# Altium schematic sheet led.SchDoc
size A4; SheetNumber: 2; SheetTotal: 4
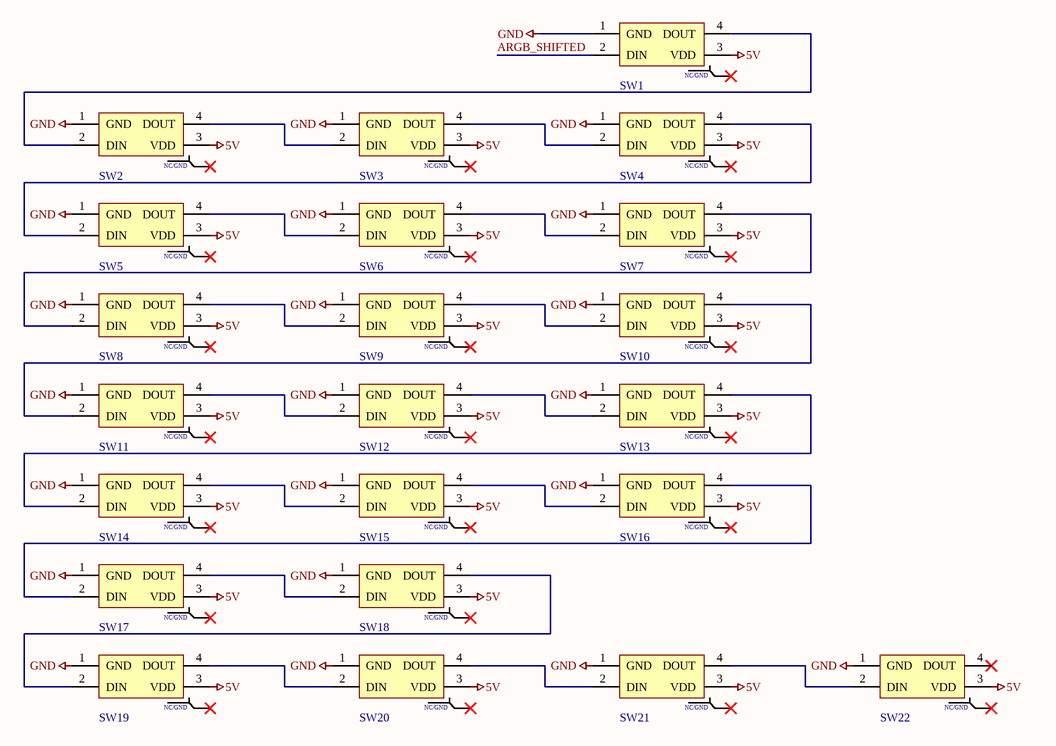
[diagram p0: led.SchDoc]

## Parts
SW1  Switch  [Switch]  (value not drawn)
SW2  Switch  [Switch]  (value not drawn)
SW3  Switch  [Switch]  (value not drawn)
SW4  Switch  [Switch]  (value not drawn)
SW5  Switch  [Switch]  (value not drawn)
SW6  Switch  [Switch]  (value not drawn)
SW7  Switch  [Switch]  (value not drawn)
SW8  Switch  [Switch]  (value not drawn)
SW9  Switch  [Switch]  (value not drawn)
SW10  Switch  [Switch]  (value not drawn)
SW11  Switch  [Switch]  (value not drawn)
SW12  Switch  [Switch]  (value not drawn)
SW13  Switch  [Switch]  (value not drawn)
SW14  Switch  [Switch]  (value not drawn)
SW15  Switch  [Switch]  (value not drawn)
SW16  Switch  [Switch]  (value not drawn)
SW17  Switch  [Switch]  (value not drawn)
SW18  Switch  [Switch]  (value not drawn)
SW19  Switch  [Switch]  (value not drawn)
SW20  Switch  [Switch]  (value not drawn)
SW21  Switch  [Switch]  (value not drawn)
SW22  Switch  [Switch]  (value not drawn)

## Nets
5V: SW1.3(VDD) SW2.3(VDD) SW3.3(VDD) SW4.3(VDD) SW5.3(VDD) SW6.3(VDD) SW7.3(VDD) SW8.3(VDD) SW9.3(VDD) SW10.3(VDD) SW11.3(VDD) SW12.3(VDD) SW13.3(VDD) SW14.3(VDD) SW15.3(VDD) SW16.3(VDD) SW17.3(VDD) SW18.3(VDD) SW19.3(VDD) SW20.3(VDD) SW21.3(VDD) SW22.3(VDD)
GND: SW1.1(GND) SW2.1(GND) SW3.1(GND) SW4.1(GND) SW5.1(GND) SW6.1(GND) SW7.1(GND) SW8.1(GND) SW9.1(GND) SW10.1(GND) SW11.1(GND) SW12.1(GND) SW13.1(GND) SW14.1(GND) SW15.1(GND) SW16.1(GND) SW17.1(GND) SW18.1(GND) SW19.1(GND) SW20.1(GND) SW21.1(GND) SW22.1(GND)
ARGB_SHIFTED: SW1.2(DIN)
NetSW1_4: SW1.4(DOUT) SW2.2(DIN)
NetSW2_4: SW2.4(DOUT) SW3.2(DIN)
NetSW3_4: SW3.4(DOUT) SW4.2(DIN)
NetSW4_4: SW4.4(DOUT) SW5.2(DIN)
NetSW5_4: SW5.4(DOUT) SW6.2(DIN)
NetSW6_4: SW6.4(DOUT) SW7.2(DIN)
NetSW7_4: SW7.4(DOUT) SW8.2(DIN)
NetSW8_4: SW8.4(DOUT) SW9.2(DIN)
NetSW9_4: SW9.4(DOUT) SW10.2(DIN)
NetSW10_4: SW10.4(DOUT) SW11.2(DIN)
NetSW11_4: SW11.4(DOUT) SW12.2(DIN)
NetSW12_4: SW12.4(DOUT) SW13.2(DIN)
NetSW13_4: SW13.4(DOUT) SW14.2(DIN)
NetSW14_4: SW14.4(DOUT) SW15.2(DIN)
NetSW15_4: SW15.4(DOUT) SW16.2(DIN)
NetSW16_4: SW16.4(DOUT) SW17.2(DIN)
NetSW17_4: SW17.4(DOUT) SW18.2(DIN)
NetSW18_4: SW18.4(DOUT) SW19.2(DIN)
NetSW19_4: SW19.4(DOUT) SW20.2(DIN)
NetSW20_4: SW20.4(DOUT) SW21.2(DIN)
NetSW21_4: SW21.4(DOUT) SW22.2(DIN)

Not connected (* = marked no-connect by the designer): SW1 5(NC/GND)*; SW2 5(NC/GND)*; SW3 5(NC/GND)*; SW4 5(NC/GND)*; SW5 5(NC/GND)*; SW6 5(NC/GND)*; SW7 5(NC/GND)*; SW8 5(NC/GND)*; SW9 5(NC/GND)*; SW10 5(NC/GND)*; SW11 5(NC/GND)*; SW12 5(NC/GND)*; SW13 5(NC/GND)*; SW14 5(NC/GND)*; SW15 5(NC/GND)*; SW16 5(NC/GND)*; SW17 5(NC/GND)*; SW18 5(NC/GND)*; SW19 5(NC/GND)*; SW20 5(NC/GND)*; SW21 5(NC/GND)*; SW22 4(DOUT)* 5(NC/GND)*

## Library data of the parts
SW1-SW22 = Switch: Gateron Magnetic Jade Switch; BOM_GROUP: ARGB